# Altium schematic sheet FPGA_Banks.SchDoc
size B
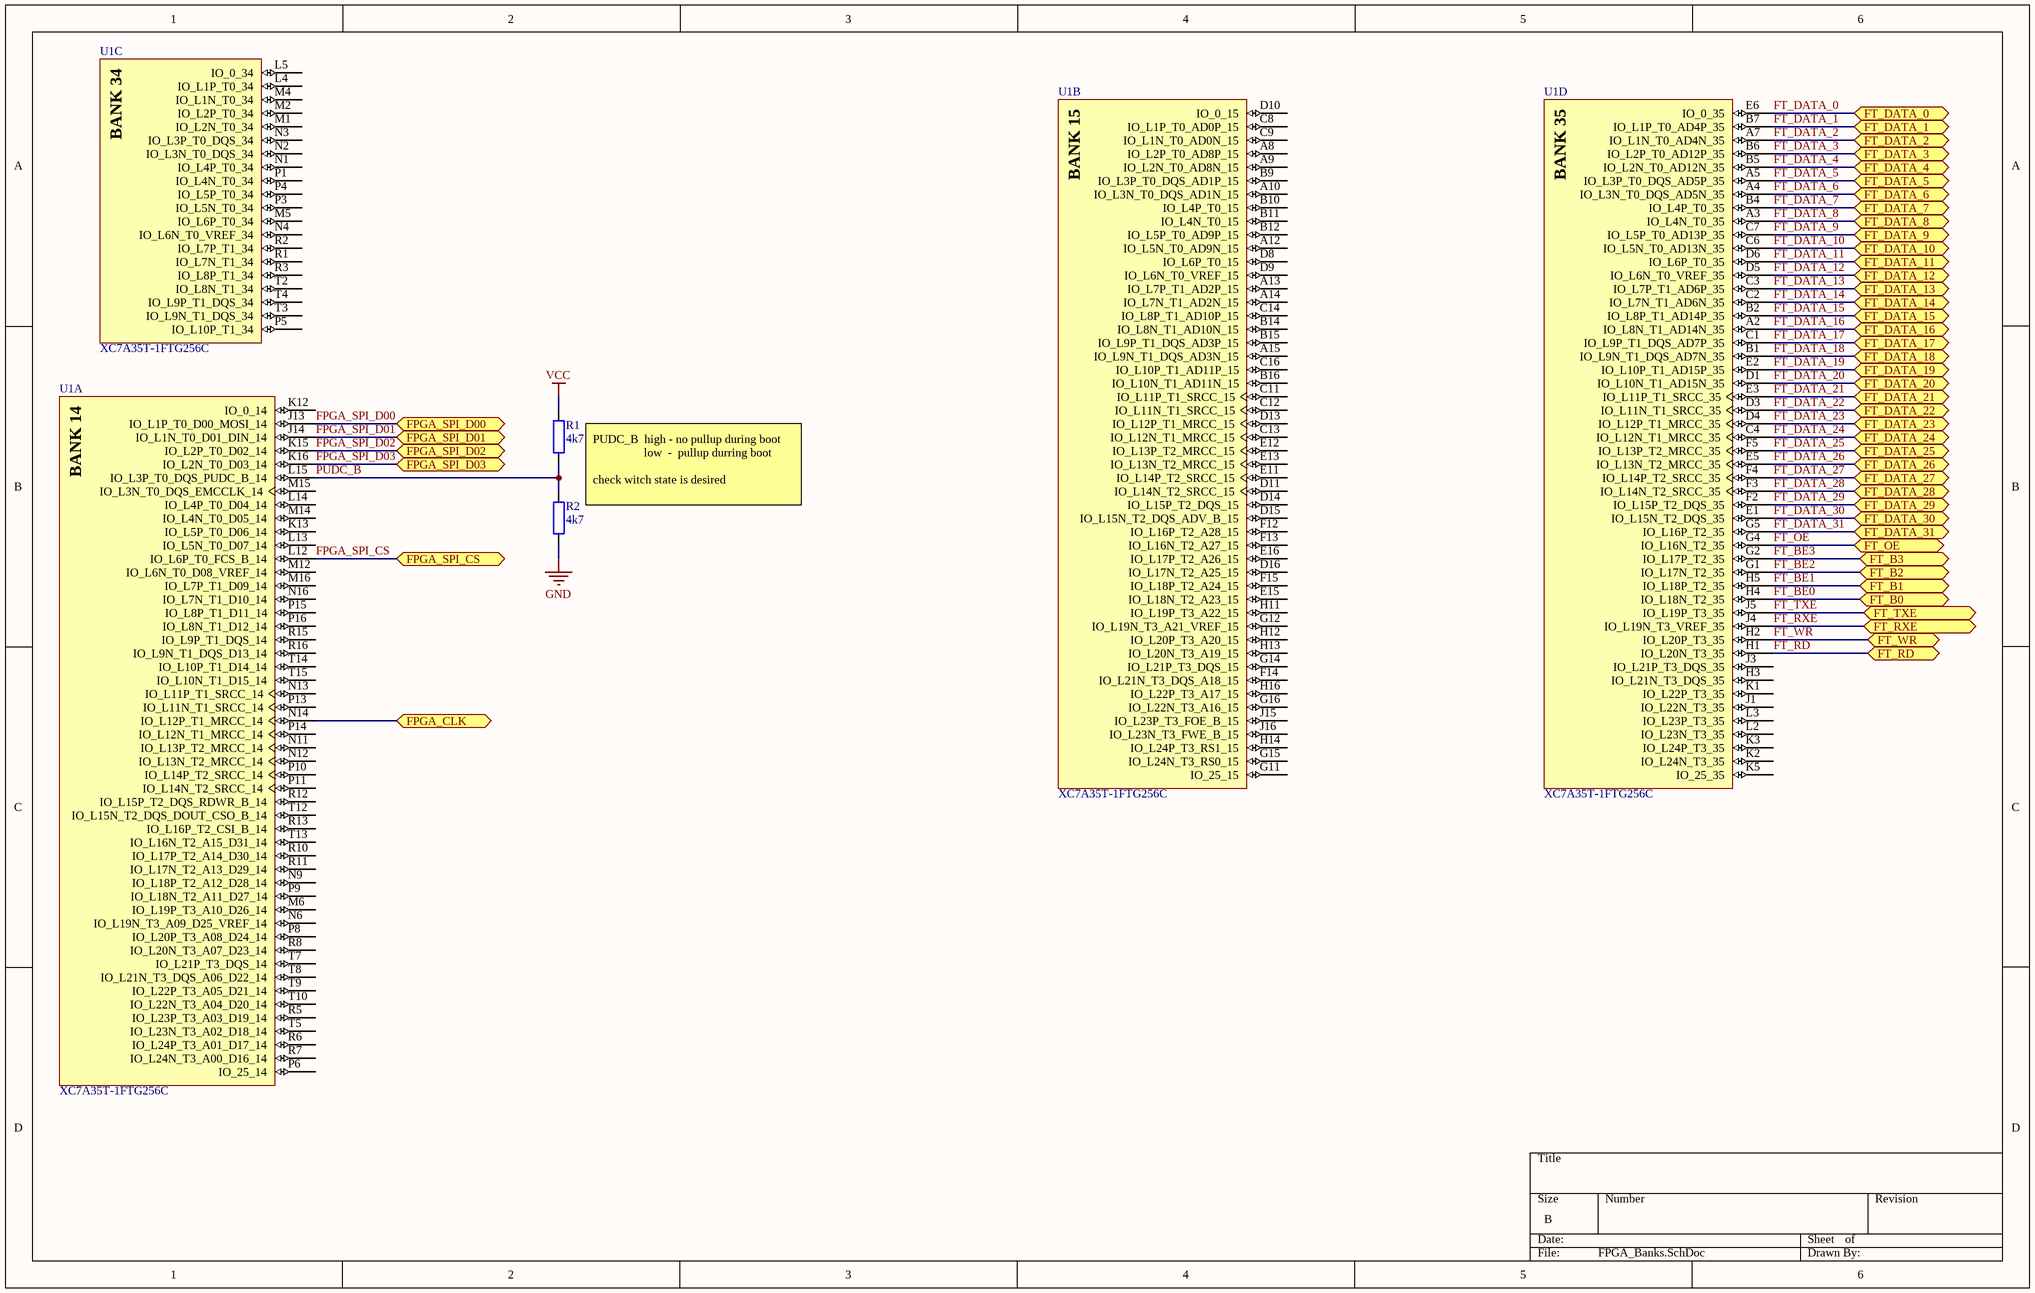
[diagram p0: FPGA_Banks.SchDoc]

## Parts
R1  4k7  [RES0402]
R2  4k7  [RES0402]
U1  XC7A35T-1FTG256C  [FTG256]  (parts A,B,C,D of 8)

## Ports
FPGA_CLK, FPGA_SPI_CS, FPGA_SPI_D00, FPGA_SPI_D01, FPGA_SPI_D02, FPGA_SPI_D03, FT_B0, FT_B1, FT_B2, FT_B3, FT_DATA_0, FT_DATA_1, FT_DATA_2, FT_DATA_3, FT_DATA_4, FT_DATA_5, FT_DATA_6, FT_DATA_7, FT_DATA_8, FT_DATA_9, FT_DATA_10, FT_DATA_11, FT_DATA_12, FT_DATA_13, FT_DATA_14, FT_DATA_15, FT_DATA_16, FT_DATA_17, FT_DATA_18, FT_DATA_19, FT_DATA_20, FT_DATA_21, FT_DATA_22, FT_DATA_23, FT_DATA_24, FT_DATA_25, FT_DATA_26, FT_DATA_27, FT_DATA_28, FT_DATA_29, FT_DATA_30, FT_DATA_31, FT_OE, FT_RD, FT_RXE, FT_TXE, FT_WR

## Nets
GND: R2.2
VCC: R1.1
FPGA_CLK: U1.N14(IO_L12P_T1_MRCC_14) ; port FPGA_CLK
FPGA_SPI_CS: U1.L12(IO_L6P_T0_FCS_B_14) ; port FPGA_SPI_CS
FPGA_SPI_D00: U1.J13(IO_L1P_T0_D00_MOSI_14) ; port FPGA_SPI_D00
FPGA_SPI_D01: U1.J14(IO_L1N_T0_D01_DIN_14) ; port FPGA_SPI_D01
FPGA_SPI_D02: U1.K15(IO_L2P_T0_D02_14) ; port FPGA_SPI_D02
FPGA_SPI_D03: U1.K16(IO_L2N_T0_D03_14) ; port FPGA_SPI_D03
FT_BE0: U1.H4(IO_L18N_T2_35) ; port FT_B0
FT_BE1: U1.H5(IO_L18P_T2_35) ; port FT_B1
FT_BE2: U1.G1(IO_L17N_T2_35) ; port FT_B2
FT_BE3: U1.G2(IO_L17P_T2_35) ; port FT_B3
FT_DATA_0: U1.E6(IO_0_35) ; port FT_DATA_0
FT_DATA_1: U1.B7(IO_L1P_T0_AD4P_35) ; port FT_DATA_1
FT_DATA_2: U1.A7(IO_L1N_T0_AD4N_35) ; port FT_DATA_2
FT_DATA_3: U1.B6(IO_L2P_T0_AD12P_35) ; port FT_DATA_3
FT_DATA_4: U1.B5(IO_L2N_T0_AD12N_35) ; port FT_DATA_4
FT_DATA_5: U1.A5(IO_L3P_T0_DQS_AD5P_35) ; port FT_DATA_5
FT_DATA_6: U1.A4(IO_L3N_T0_DQS_AD5N_35) ; port FT_DATA_6
FT_DATA_7: U1.B4(IO_L4P_T0_35) ; port FT_DATA_7
FT_DATA_8: U1.A3(IO_L4N_T0_35) ; port FT_DATA_8
FT_DATA_9: U1.C7(IO_L5P_T0_AD13P_35) ; port FT_DATA_9
FT_DATA_10: U1.C6(IO_L5N_T0_AD13N_35) ; port FT_DATA_10
FT_DATA_11: U1.D6(IO_L6P_T0_35) ; port FT_DATA_11
FT_DATA_12: U1.D5(IO_L6N_T0_VREF_35) ; port FT_DATA_12
FT_DATA_13: U1.C3(IO_L7P_T1_AD6P_35) ; port FT_DATA_13
FT_DATA_14: U1.C2(IO_L7N_T1_AD6N_35) ; port FT_DATA_14
FT_DATA_15: U1.B2(IO_L8P_T1_AD14P_35) ; port FT_DATA_15
FT_DATA_16: U1.A2(IO_L8N_T1_AD14N_35) ; port FT_DATA_16
FT_DATA_17: U1.C1(IO_L9P_T1_DQS_AD7P_35) ; port FT_DATA_17
FT_DATA_18: U1.B1(IO_L9N_T1_DQS_AD7N_35) ; port FT_DATA_18
FT_DATA_19: U1.E2(IO_L10P_T1_AD15P_35) ; port FT_DATA_19
FT_DATA_20: U1.D1(IO_L10N_T1_AD15N_35) ; port FT_DATA_20
FT_DATA_21: U1.E3(IO_L11P_T1_SRCC_35) ; port FT_DATA_21
FT_DATA_22: U1.D3(IO_L11N_T1_SRCC_35) ; port FT_DATA_22
FT_DATA_23: U1.D4(IO_L12P_T1_MRCC_35) ; port FT_DATA_23
FT_DATA_24: U1.C4(IO_L12N_T1_MRCC_35) ; port FT_DATA_24
FT_DATA_25: U1.F5(IO_L13P_T2_MRCC_35) ; port FT_DATA_25
FT_DATA_26: U1.E5(IO_L13N_T2_MRCC_35) ; port FT_DATA_26
FT_DATA_27: U1.F4(IO_L14P_T2_SRCC_35) ; port FT_DATA_27
FT_DATA_28: U1.F3(IO_L14N_T2_SRCC_35) ; port FT_DATA_28
FT_DATA_29: U1.F2(IO_L15P_T2_DQS_35) ; port FT_DATA_29
FT_DATA_30: U1.E1(IO_L15N_T2_DQS_35) ; port FT_DATA_30
FT_DATA_31: U1.G5(IO_L16P_T2_35) ; port FT_DATA_31
FT_OE: U1.G4(IO_L16N_T2_35) ; port FT_OE
FT_RD: U1.H1(IO_L20N_T3_35) ; port FT_RD
FT_RXE: U1.J4(IO_L19N_T3_VREF_35) ; port FT_RXE
FT_TXE: U1.J5(IO_L19P_T3_35) ; port FT_TXE
FT_WR: U1.H2(IO_L20P_T3_35) ; port FT_WR
PUDC_B: R1.2 R2.1 U1.L15(IO_L3P_T0_DQS_PUDC_B_14)

Not connected (* = marked no-connect by the designer): U1 A8(IO_L2P_T0_AD8P_15) A9(IO_L2N_T0_AD8N_15) A10(IO_L3N_T0_DQS_AD1N_15) A12(IO_L5N_T0_AD9N_15) A13(IO_L7P_T1_AD2P_15) A14(IO_L7N_T1_AD2N_15) A15(IO_L9N_T1_DQS_AD3N_15) B9(IO_L3P_T0_DQS_AD1P_15) B10(IO_L4P_T0_15) B11(IO_L4N_T0_15) B12(IO_L5P_T0_AD9P_15) B14(IO_L8N_T1_AD10N_15) B15(IO_L9P_T1_DQS_AD3P_15) B16(IO_L10N_T1_AD11N_15) C8(IO_L1P_T0_AD0P_15) C9(IO_L1N_T0_AD0N_15) C11(IO_L11P_T1_SRCC_15) C12(IO_L11N_T1_SRCC_15) C13(IO_L12N_T1_MRCC_15) C14(IO_L8P_T1_AD10P_15) C16(IO_L10P_T1_AD11P_15) D8(IO_L6P_T0_15) D9(IO_L6N_T0_VREF_15) D10(IO_0_15) D11(IO_L14N_T2_SRCC_15) D13(IO_L12P_T1_MRCC_15) D14(IO_L15P_T2_DQS_15) D15(IO_L15N_T2_DQS_ADV_B_15) D16(IO_L17N_T2_A25_15) E11(IO_L14P_T2_SRCC_15) E12(IO_L13P_T2_MRCC_15) E13(IO_L13N_T2_MRCC_15) E15(IO_L18N_T2_A23_15) E16(IO_L17P_T2_A26_15) F12(IO_L16P_T2_A28_15) F13(IO_L16N_T2_A27_15) F14(IO_L21N_T3_DQS_A18_15) F15(IO_L18P_T2_A24_15) G11(IO_25_15) G12(IO_L19N_T3_A21_VREF_15) G14(IO_L21P_T3_DQS_15) G15(IO_L24N_T3_RS0_15) G16(IO_L22N_T3_A16_15) H3(IO_L21N_T3_DQS_35) H11(IO_L19P_T3_A22_15) H12(IO_L20P_T3_A20_15) H13(IO_L20N_T3_A19_15) H14(IO_L24P_T3_RS1_15) H16(IO_L22P_T3_A17_15) J1(IO_L22N_T3_35) J3(IO_L21P_T3_DQS_35) J15(IO_L23P_T3_FOE_B_15) J16(IO_L23N_T3_FWE_B_15) K1(IO_L22P_T3_35) K2(IO_L24N_T3_35) K3(IO_L24P_T3_35) K5(IO_25_35) K12(IO_0_14) K13(IO_L5P_T0_D06_14) L2(IO_L23N_T3_35) L3(IO_L23P_T3_35) L4(IO_L1P_T0_34) L5(IO_0_34) L13(IO_L5N_T0_D07_14) L14(IO_L4P_T0_D04_14) M1(IO_L2N_T0_34) M2(IO_L2P_T0_34) M4(IO_L1N_T0_34) M5(IO_L6P_T0_34) M6(IO_L19P_T3_A10_D26_14) M12(IO_L6N_T0_D08_VREF_14) M14(IO_L4N_T0_D05_14) M15(IO_L3N_T0_DQS_EMCCLK_14) M16(IO_L7P_T1_D09_14) N1(IO_L4P_T0_34) N2(IO_L3N_T0_DQS_34) N3(IO_L3P_T0_DQS_34) N4(IO_L6N_T0_VREF_34) N6(IO_L19N_T3_A09_D25_VREF_14) N9(IO_L18P_T2_A12_D28_14) N11(IO_L13P_T2_MRCC_14) N12(IO_L13N_T2_MRCC_14) N13(IO_L11P_T1_SRCC_14) N16(IO_L7N_T1_D10_14) P1(IO_L4N_T0_34) P3(IO_L5N_T0_34) P4(IO_L5P_T0_34) P5(IO_L10P_T1_34) P6(IO_25_14) P8(IO_L20P_T3_A08_D24_14) P9(IO_L18N_T2_A11_D27_14) P10(IO_L14P_T2_SRCC_14) P11(IO_L14N_T2_SRCC_14) P13(IO_L11N_T1_SRCC_14) P14(IO_L12N_T1_MRCC_14) P15(IO_L8P_T1_D11_14) P16(IO_L8N_T1_D12_14) R1(IO_L7N_T1_34) R2(IO_L7P_T1_34) R3(IO_L8P_T1_34) R5(IO_L23P_T3_A03_D19_14) R6(IO_L24P_T3_A01_D17_14) R7(IO_L24N_T3_A00_D16_14) R8(IO_L20N_T3_A07_D23_14) R10(IO_L17P_T2_A14_D30_14) R11(IO_L17N_T2_A13_D29_14) R12(IO_L15P_T2_DQS_RDWR_B_14) R13(IO_L16P_T2_CSI_B_14) R15(IO_L9P_T1_DQS_14) R16(IO_L9N_T1_DQS_D13_14) T2(IO_L8N_T1_34) T3(IO_L9N_T1_DQS_34) T4(IO_L9P_T1_DQS_34) T5(IO_L23N_T3_A02_D18_14) T7(IO_L21P_T3_DQS_14) T8(IO_L21N_T3_DQS_A06_D22_14) T9(IO_L22P_T3_A05_D21_14) T10(IO_L22N_T3_A04_D20_14) T12(IO_L15N_T2_DQS_DOUT_CSO_B_14) T13(IO_L16N_T2_A15_D31_14) T14(IO_L10P_T1_D14_14) T15(IO_L10N_T1_D15_14)

## Notes on the sheet
- PUDC_B  high - no pullup during boot
  low  -  pullup durring boot
  check witch state is desired
- (in symbol XC7A35T-1FTG256C, part A) BANK 14
- (in symbol XC7A35T-1FTG256C, part B) BANK 15
- (in symbol XC7A35T-1FTG256C, part C) BANK 34
- (in symbol XC7A35T-1FTG256C, part D) BANK 35

## Library data of the parts
R1 R2 = Res_0402: Value: 4k7
U1 = XC7A35T-1FTG256C: Artix-7 FPGA, 170 User I/Os, 0 GTP, 256-Ball BGA, Speed Grade 1, Commercial Grade, Pb-Free; Manufacturer: Xilinx; Total Block RAM: 1800 Kb; GTP: 0; Clock Mgmt Tiles (CMTs): 5; Logic Cells: 33280; Available User I/O: 170; Speed Grades: 1; DatasheetVersion: v1.15; PackageVersion: Rev. 1.11; PackageReference: FTG-256; PackageDescription: 256-Ball Wire-Bond Fine-Pitch Thin BGA, Body 17 x 17 mm, Pitch 1 mm; Maximum Distributed RAM: 400 Kb; Operating Temperature Range: Commercial; NexusDeviceID: XC7A35T-1FTG256C; Mounting Technology: Surface Mount; PartNumber: XC7A35T-1FTG256C; ComponentLink1Description: Manufacturer URL; ComponentLink1URL: http://www.xilinx.com/; ComponentLink2Description: Datasheet; ComponentLink2URL: http://www.xilinx.com/support/documentation/data_sheets/ds180_7Series_Overview.pdf; ComponentLink3Description: Package Specification; ComponentLink3URL: http://www.xilinx.com/support/documentation/user_guides/ug475_7Series_Pkg_Pinout.pdf; ComponentLink4Description: DC and Switching Characteristics; ComponentLink4URL: http://www.xilinx.com/support/documentation/data_sheets/ds181_Artix_7_Data_Sheet.pdf; ComponentLink5Description: Package File; ComponentLink5URL: http://www.xilinx.com/support/packagefiles/a7packages/xc7a200tsbg484pkg.txt; ComponentLink6Description: Packaging and Pinout; ComponentLink6URL: http://www.xilinx.com/support/documentation/user_guides/ug475_7Series_Pkg_Pinout.pdf